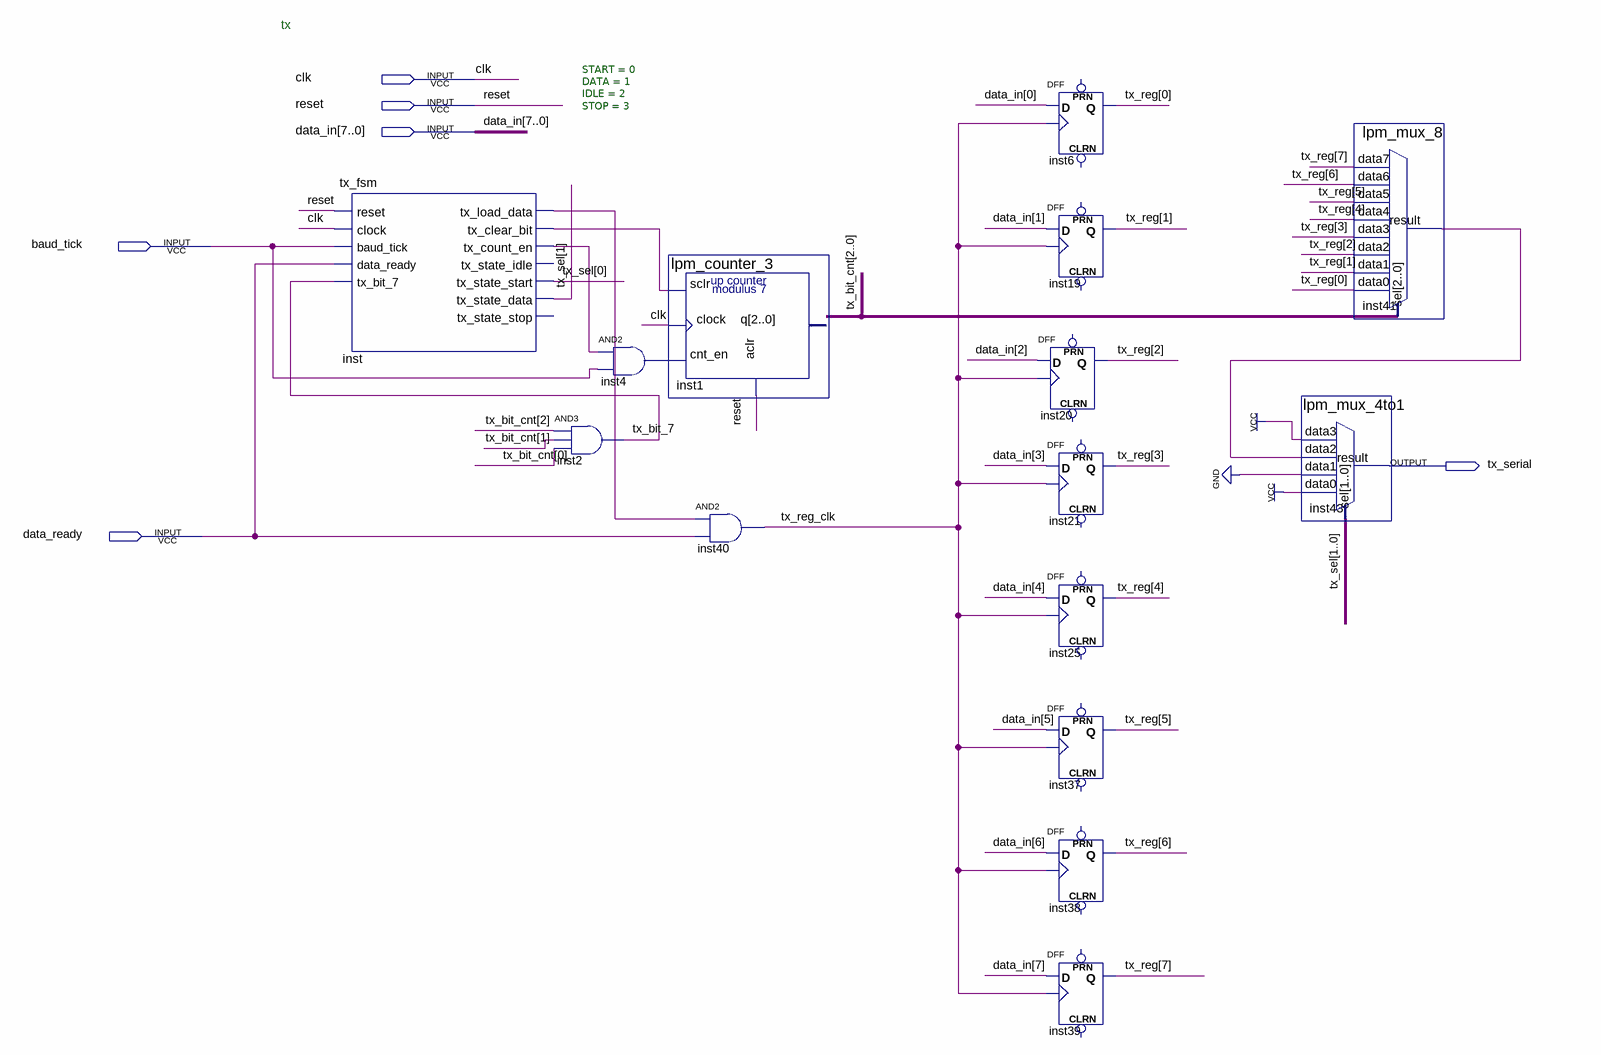
[diagram p0: schematic sheet]
// Quartus schematic tx.bdf as structural Verilog: 15 symbols, 6 pins
module tx (
  input  clk,
  input  reset,
  input  [7:0] data_in,
  input  baud_tick,
  input  data_ready,
  output tx_serial
);

  wire inst4_out, inst41_result, inst_tx_clear_bit, inst_tx_count_en, inst_tx_load_data, tx_bit_7, tx_reg_clk;
  wire [1:0] tx_sel;
  wire [2:0] tx_bit_cnt;
  wire [7:0] tx_reg;

  tx_fsm #(.START(0), .DATA(1), .IDLE(2), .STOP(3)) inst (
    .reset(reset), .clock(clk), .baud_tick(baud_tick), .data_ready(data_ready), .tx_bit_7(tx_bit_7),
    .tx_load_data(inst_tx_load_data), .tx_clear_bit(inst_tx_clear_bit), .tx_count_en(inst_tx_count_en),
    .tx_state_start(tx_sel[0]), .tx_state_data(tx_sel[1]));  // open: tx_state_idle, tx_state_stop
  and inst4 (inst4_out, inst_tx_count_en, baud_tick);
  and inst2 (tx_bit_7, tx_bit_cnt[2], tx_bit_cnt[1], tx_bit_cnt[0]);
  lpm_counter_3 inst1 (.sclr(inst_tx_clear_bit), .clock(clk), .cnt_en(inst4_out), .aclr(reset));  // open: q
  and inst40 (tx_reg_clk, inst_tx_load_data, data_ready);
  DFF inst20 (.CLK(tx_reg_clk), .D(data_in[2]), .Q(tx_reg[2]));  // open: CLRN, PRN
  DFF inst6 (.CLK(tx_reg_clk), .D(data_in[0]), .Q(tx_reg[0]));  // open: CLRN, PRN
  DFF inst19 (.CLK(tx_reg_clk), .D(data_in[1]), .Q(tx_reg[1]));  // open: CLRN, PRN
  DFF inst21 (.CLK(tx_reg_clk), .D(data_in[3]), .Q(tx_reg[3]));  // open: CLRN, PRN
  DFF inst25 (.CLK(tx_reg_clk), .D(data_in[4]), .Q(tx_reg[4]));  // open: CLRN, PRN
  DFF inst37 (.CLK(tx_reg_clk), .D(data_in[5]), .Q(tx_reg[5]));  // open: CLRN, PRN
  DFF inst38 (.CLK(tx_reg_clk), .D(data_in[6]), .Q(tx_reg[6]));  // open: CLRN, PRN
  DFF inst39 (.CLK(tx_reg_clk), .D(data_in[7]), .Q(tx_reg[7]));  // open: CLRN, PRN
  lpm_mux_4to1 inst43 (
    .data3(1'b1), .data2(inst41_result), .data1(1'b0), .data0(1'b1), .sel(tx_sel), .result(tx_serial));
  lpm_mux_8 inst41 (
    .data7(tx_reg[7]), .data6(tx_reg[6]), .data5(tx_reg[5]), .data4(tx_reg[4]), .data3(tx_reg[3]),
    .data2(tx_reg[2]), .data1(tx_reg[1]), .data0(tx_reg[0]), .sel(tx_bit_cnt), .result(inst41_result));

  // Notes on the sheet:
  //   tx
endmodule
